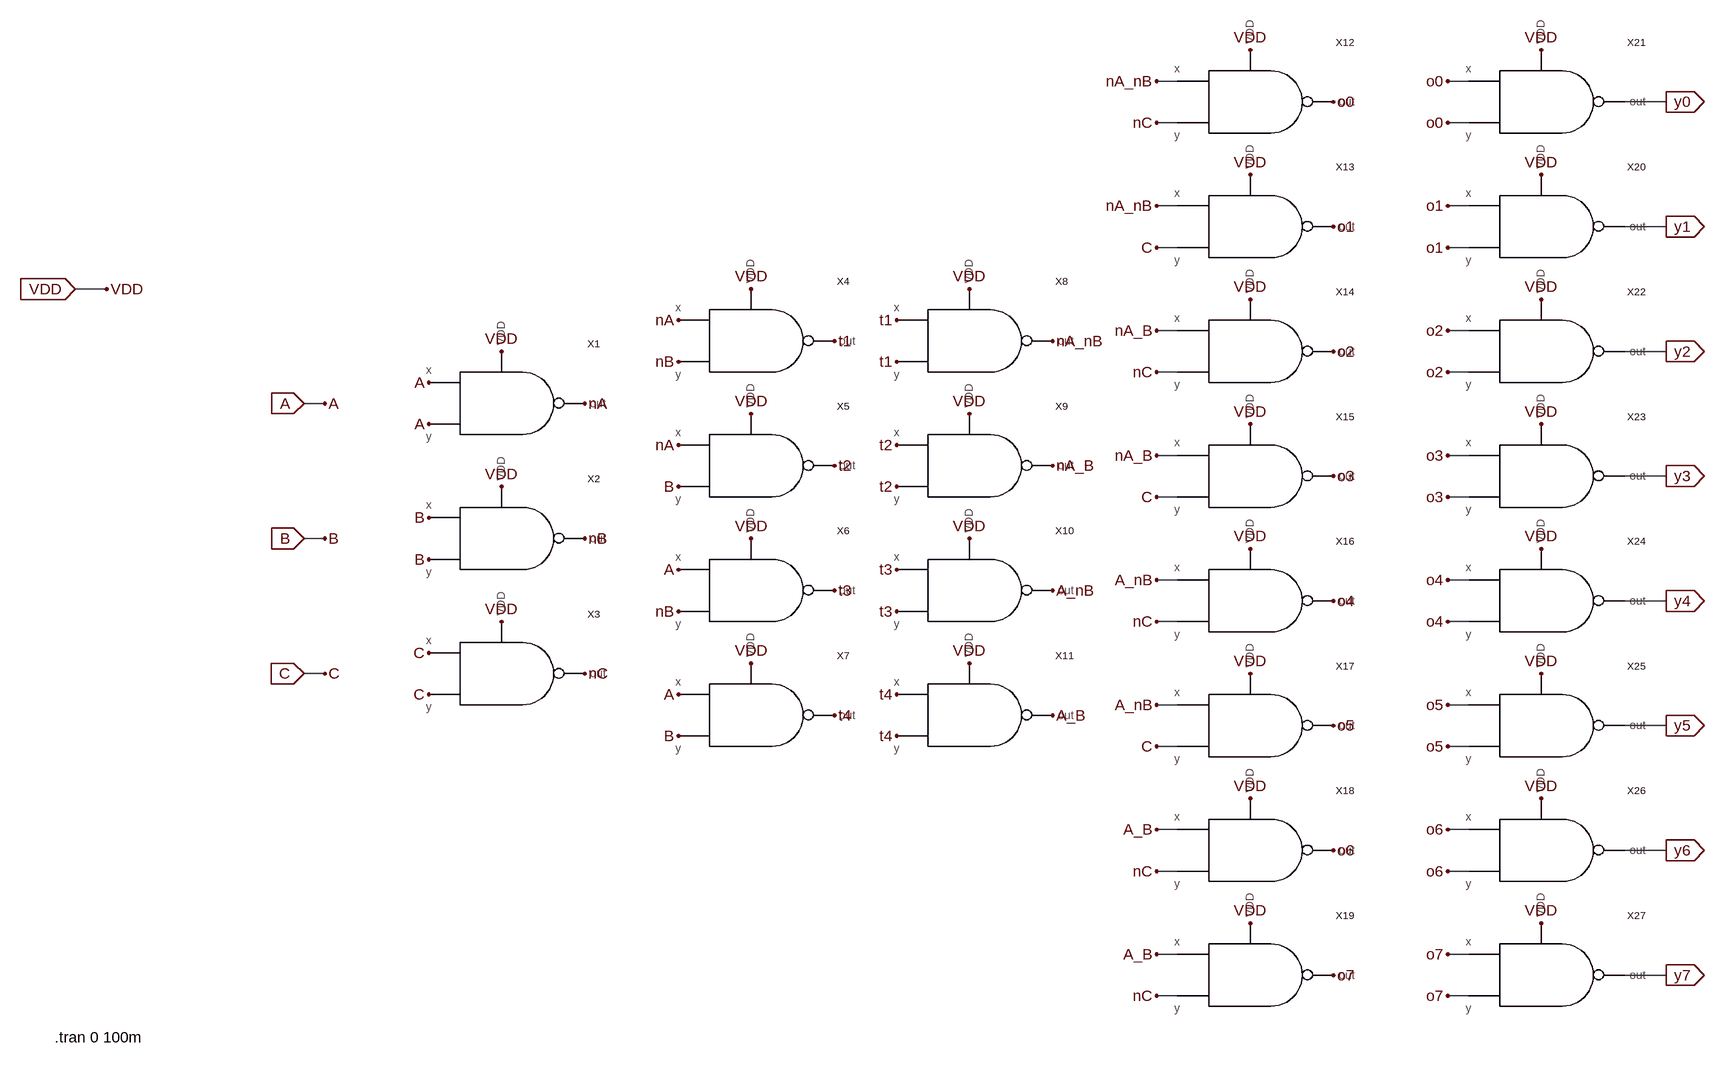
[diagram p0: schematic decoder_final.asc]
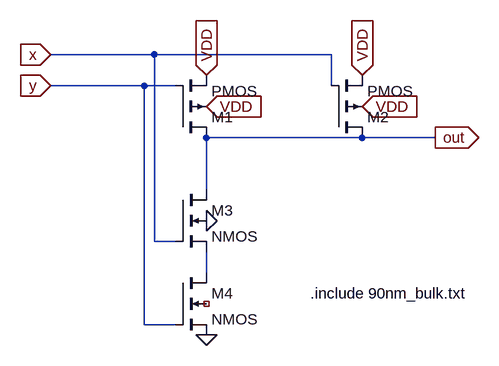
[diagram p1: sub-circuit nand.asc]
decoder_final.asc, the LTspice schematic file:
Version 4.1
SHEET 1 2072 1384
WIRE 1232 -352 1200 -352
WIRE 1680 -352 1648 -352
WIRE 1984 -320 1920 -320
WIRE 1232 -288 1200 -288
WIRE 1680 -288 1648 -288
WIRE 1232 -160 1200 -160
WIRE 1680 -160 1648 -160
WIRE 1984 -128 1920 -128
WIRE 1232 -96 1200 -96
WIRE 1680 -96 1648 -96
WIRE -416 -32 -464 -32
WIRE 1232 32 1200 32
WIRE 1680 32 1648 32
WIRE 1984 64 1920 64
WIRE 1232 96 1200 96
WIRE 1680 96 1648 96
WIRE -80 144 -112 144
WIRE 1232 224 1200 224
WIRE 1680 224 1648 224
WIRE 1984 256 1920 256
WIRE 1232 288 1200 288
WIRE 1680 288 1648 288
WIRE -80 352 -112 352
WIRE 1232 416 1200 416
WIRE 1680 416 1648 416
WIRE 1984 448 1920 448
WIRE 1232 480 1200 480
WIRE 1680 480 1648 480
WIRE -80 560 -112 560
WIRE 1232 608 1200 608
WIRE 1680 608 1648 608
WIRE 1984 640 1920 640
WIRE 1232 672 1200 672
WIRE 1680 672 1648 672
WIRE 1232 800 1200 800
WIRE 1680 800 1648 800
WIRE 1984 832 1920 832
WIRE 1232 864 1200 864
WIRE 1680 864 1648 864
WIRE 1232 992 1200 992
WIRE 1680 992 1648 992
WIRE 1984 1024 1920 1024
WIRE 1232 1056 1200 1056
WIRE 1680 1056 1648 1056
FLAG 192 64 VDD
FLAG 192 272 VDD
FLAG 192 480 VDD
FLAG -112 144 A
IOPIN -112 144 In
FLAG -112 352 B
IOPIN -112 352 In
FLAG -112 560 C
IOPIN -112 560 In
FLAG 80 112 A
FLAG 80 176 A
FLAG 80 320 B
FLAG 80 384 B
FLAG 80 528 C
FLAG 80 592 C
FLAG 320 144 nA
FLAG 320 352 nB
FLAG 320 560 nC
FLAG 464 16 nA
FLAG 464 80 nB
FLAG 464 208 nA
FLAG 464 272 B
FLAG 464 400 A
FLAG 464 464 nB
FLAG 464 592 A
FLAG 464 656 B
FLAG 704 240 t2
FLAG 704 48 t1
FLAG 704 432 t3
FLAG 704 624 t4
FLAG 576 160 VDD
FLAG 576 352 VDD
FLAG 576 -32 VDD
FLAG 576 544 VDD
FLAG 800 16 t1
FLAG 800 80 t1
FLAG 800 208 t2
FLAG 800 272 t2
FLAG 800 400 t3
FLAG 800 464 t3
FLAG 800 592 t4
FLAG 800 656 t4
FLAG 1040 240 nA_B
FLAG 1040 48 nA_nB
FLAG 1040 432 A_nB
FLAG 1040 624 A_B
FLAG 912 160 VDD
FLAG 912 352 VDD
FLAG 912 -32 VDD
FLAG 912 544 VDD
FLAG 1344 -208 VDD
FLAG 1344 -16 VDD
FLAG 1344 -400 VDD
FLAG 1344 176 VDD
FLAG 1344 368 VDD
FLAG 1344 560 VDD
FLAG 1344 752 VDD
FLAG 1344 944 VDD
FLAG 1200 416 A_nB
FLAG 1200 288 C
FLAG 1200 224 nA_B
FLAG 1200 96 nC
FLAG 1200 32 nA_B
FLAG 1200 -96 C
FLAG 1200 -160 nA_nB
FLAG 1200 -288 nC
FLAG 1200 -352 nA_nB
FLAG 1200 480 nC
FLAG 1200 608 A_nB
FLAG 1200 672 C
FLAG 1200 800 A_B
FLAG 1200 864 nC
FLAG 1200 992 A_B
FLAG 1200 1056 nC
FLAG 1792 -208 VDD
FLAG 1472 -128 o1
FLAG 1648 -160 o1
FLAG 1648 -96 o1
FLAG 1472 -320 o0
FLAG 1472 1024 o7
FLAG 1472 832 o6
FLAG 1472 640 o5
FLAG 1472 448 o4
FLAG 1472 256 o3
FLAG 1472 64 o2
FLAG 1984 -128 y1
IOPIN 1984 -128 Out
FLAG 1792 -400 VDD
FLAG 1648 -352 o0
FLAG 1648 -288 o0
FLAG 1984 -320 y0
IOPIN 1984 -320 Out
FLAG 1792 -16 VDD
FLAG 1648 32 o2
FLAG 1648 96 o2
FLAG 1984 64 y2
IOPIN 1984 64 Out
FLAG 1792 176 VDD
FLAG 1648 224 o3
FLAG 1648 288 o3
FLAG 1984 256 y3
IOPIN 1984 256 Out
FLAG 1792 368 VDD
FLAG 1648 416 o4
FLAG 1648 480 o4
FLAG 1984 448 y4
IOPIN 1984 448 Out
FLAG 1792 560 VDD
FLAG 1648 608 o5
FLAG 1648 672 o5
FLAG 1984 640 y5
IOPIN 1984 640 Out
FLAG 1792 752 VDD
FLAG 1648 800 o6
FLAG 1648 864 o6
FLAG 1984 832 y6
IOPIN 1984 832 Out
FLAG 1792 944 VDD
FLAG 1648 992 o7
FLAG 1648 1056 o7
FLAG 1984 1024 y7
IOPIN 1984 1024 Out
FLAG -80 560 C
FLAG -80 352 B
FLAG -80 144 A
FLAG -464 -32 VDD
IOPIN -464 -32 In
FLAG -416 -32 VDD
SYMBOL nand 176 144 R0
SYMATTR InstName X1
SYMBOL nand 176 352 R0
SYMATTR InstName X2
SYMBOL nand 176 560 R0
SYMATTR InstName X3
SYMBOL nand 560 48 R0
SYMATTR InstName X4
SYMBOL nand 560 240 R0
SYMATTR InstName X5
SYMBOL nand 560 432 R0
SYMATTR InstName X6
SYMBOL nand 560 624 R0
SYMATTR InstName X7
SYMBOL nand 896 48 R0
SYMATTR InstName X8
SYMBOL nand 896 240 R0
SYMATTR InstName X9
SYMBOL nand 896 432 R0
SYMATTR InstName X10
SYMBOL nand 896 624 R0
SYMATTR InstName X11
SYMBOL nand 1328 -320 R0
SYMATTR InstName X12
SYMBOL nand 1328 -128 R0
SYMATTR InstName X13
SYMBOL nand 1328 64 R0
SYMATTR InstName X14
SYMBOL nand 1328 256 R0
SYMATTR InstName X15
SYMBOL nand 1328 448 R0
SYMATTR InstName X16
SYMBOL nand 1328 640 R0
SYMATTR InstName X17
SYMBOL nand 1328 832 R0
SYMATTR InstName X18
SYMBOL nand 1328 1024 R0
SYMATTR InstName X19
SYMBOL nand 1776 -128 R0
SYMATTR InstName X20
SYMBOL nand 1776 -320 R0
SYMATTR InstName X21
SYMBOL nand 1776 64 R0
SYMATTR InstName X22
SYMBOL nand 1776 256 R0
SYMATTR InstName X23
SYMBOL nand 1776 448 R0
SYMATTR InstName X24
SYMBOL nand 1776 640 R0
SYMATTR InstName X25
SYMBOL nand 1776 832 R0
SYMATTR InstName X26
SYMBOL nand 1776 1024 R0
SYMATTR InstName X27
TEXT -496 1120 Left 2 !.tran 0 100m

nand.asc, the sub-circuit schematic file:
Version 4.1
SHEET 1 880 680
WIRE 96 32 -64 32
WIRE 368 32 96 32
WIRE 80 80 -64 80
WIRE 128 80 80 80
WIRE 368 80 368 32
WIRE 416 160 176 160
WIRE 528 160 416 160
WIRE 176 240 176 160
WIRE 96 320 96 32
WIRE 128 320 96 320
WIRE 176 368 176 336
WIRE 80 448 80 80
WIRE 128 448 80 448
FLAG 176 464 0
FLAG 176 288 0
FLAG -64 80 y
IOPIN -64 80 In
FLAG -64 32 x
IOPIN -64 32 In
FLAG 416 64 VDD
IOPIN 416 64 In
FLAG 416 112 VDD
IOPIN 416 112 In
FLAG 176 112 VDD
IOPIN 176 112 In
FLAG 176 64 VDD
IOPIN 176 64 In
FLAG 528 160 out
IOPIN 528 160 Out
SYMBOL pmos4 128 160 M180
SYMATTR InstName M1
SYMBOL pmos4 368 160 M180
SYMATTR InstName M2
SYMBOL nmos4 128 240 R0
SYMATTR InstName M3
SYMBOL nmos4 128 368 R0
SYMATTR InstName M4
TEXT 336 400 Left 2 !.include 90nm_bulk.txt

The netlist it stands for:
* decoder_final.asc
X§X1 A A nA VDD nand
X§X2 B B nB VDD nand
X§X3 C C nC VDD nand
X§X4 nA nB t1 VDD nand
X§X5 nA B t2 VDD nand
X§X6 A nB t3 VDD nand
X§X7 A B t4 VDD nand
X§X8 t1 t1 nA_nB VDD nand
X§X9 t2 t2 nA_B VDD nand
X§X10 t3 t3 A_nB VDD nand
X§X11 t4 t4 A_B VDD nand
X§X12 nA_nB nC o0 VDD nand
X§X13 nA_nB C o1 VDD nand
X§X14 nA_B nC o2 VDD nand
X§X15 nA_B C o3 VDD nand
X§X16 A_nB nC o4 VDD nand
X§X17 A_nB C o5 VDD nand
X§X18 A_B nC o6 VDD nand
X§X19 A_B nC o7 VDD nand
X§X20 o1 o1 y1 VDD nand
X§X21 o0 o0 y0 VDD nand
X§X22 o2 o2 y2 VDD nand
X§X23 o3 o3 y3 VDD nand
X§X24 o4 o4 y4 VDD nand
X§X25 o5 o5 y5 VDD nand
X§X26 o6 o6 y6 VDD nand
X§X27 o7 o7 y7 VDD nand

* block symbol definitions
.subckt nand x y out VDD
M1 out y VDD VDD PMOS
M2 out x VDD VDD PMOS
M3 out x N001 0 NMOS
M4 N001 y 0 NC_01 NMOS
.include 90nm_bulk.txt
.ends nand

.model NMOS NMOS
.model PMOS PMOS
.lib standard.mos
.tran 0 100m
.backanno
.end